# EAGLE design untitled2 (EAGLE 6.1)
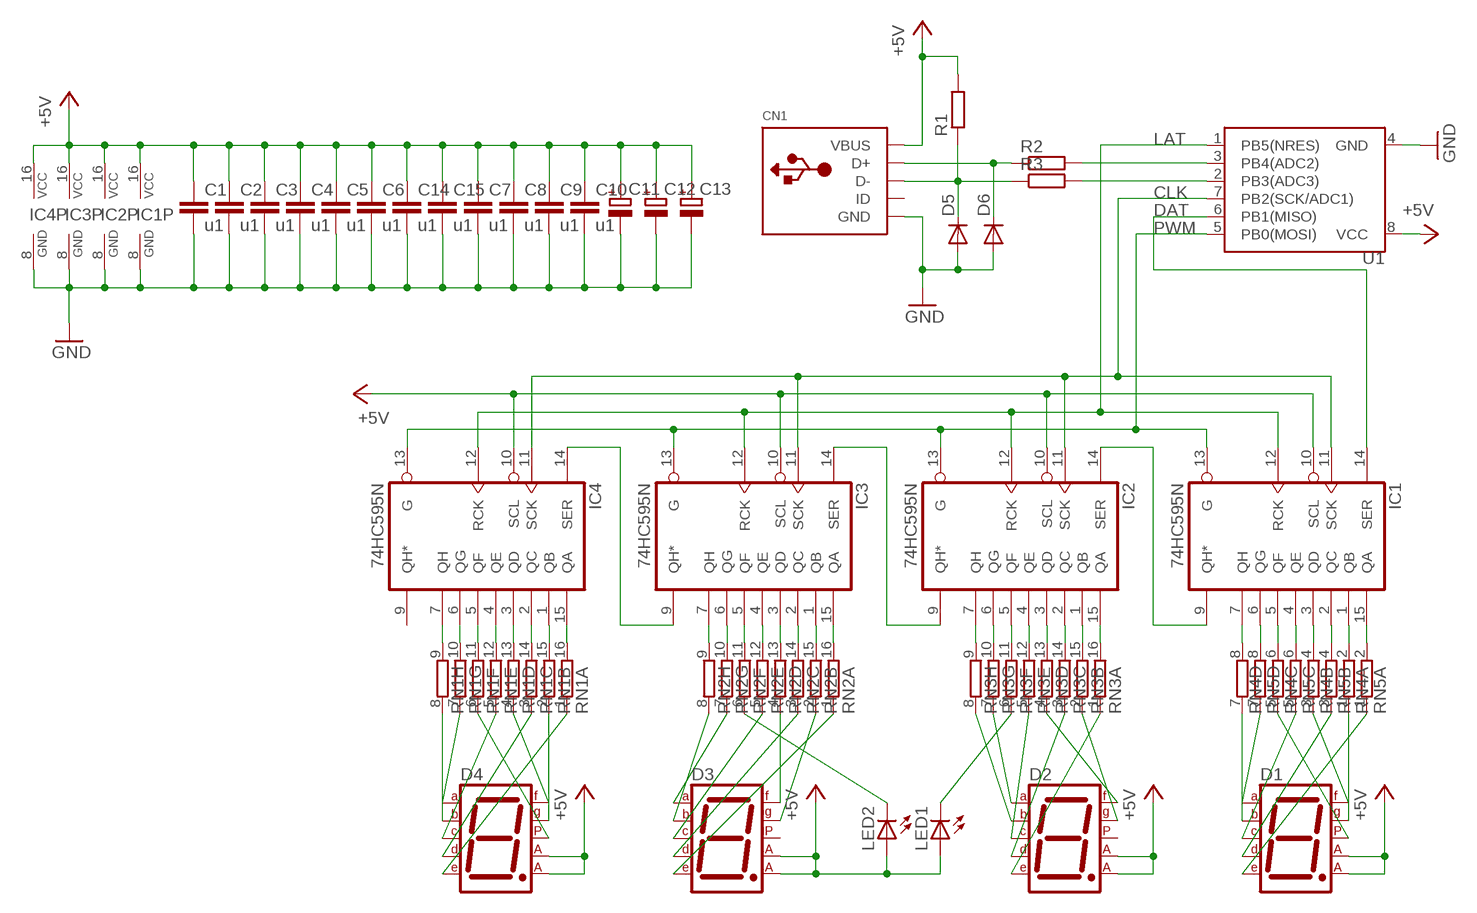
[diagram p0: schematic, sheet 1]

## Parts
C1  u1  C-EU025-025X050  [C025-025X050]
C2  u1  C-EU025-025X050  [C025-025X050]
C3  u1  C-EU025-025X050  [C025-025X050]
C4  u1  C-EU025-025X050  [C025-025X050]
C5  u1  C-EU025-025X050  [C025-025X050]
C6  u1  C-EU025-025X050  [C025-025X050]
C7  u1  C-EUC0805K  [C0805K]
C8  u1  C-EUC0805K  [C0805K]
C9  u1  C-EUC0805K  [C0805K]
C10  u1  C-EUC0805K  [C0805K]
C11  CPOL-EUE1.8-4  [E1,8-4]
C12  CPOL-EUE2.5-7  [E2,5-7]
C13  CPOL-EUE2.5-7  [E2,5-7]
C14  u1  C-EU025-025X050  [C025-025X050]
C15  u1  C-EU025-025X050  [C025-025X050]
CN1  USBTHM  [USB-MINIB-THM]
D1  7SEG-CA  [7SEG-13]
D2  7SEG-CA  [7SEG-13]
D3  7SEG-CA  [7SEG-13]
D4  7SEG-CA  [7SEG-13]
D5  DIODE-D-7.5  [D-7.5]
D6  DIODE-D-7.5  [D-7.5]
IC1  74HC595N  [DIL16]
IC2  74HC595N  [DIL16]
IC3  74HC595N  [DIL16]
IC4  74HC595N  [DIL16]
LED1  LED3MM  [LED3MM]
LED2  LED3MM  [LED3MM]
R1  R-EU_0204/7  [0204/7]
R2  R-EU_0204/7  [0204/7]
R3  R-EU_0204/7  [0204/7]
RN1  8R-N  [DIL16]
RN2  8R-N  [DIL16]
RN3  8R-N  [DIL16]
RN4  E4R  [SIL8]
RN5  E4R  [SIL8]
U1  ATTINY45ATTINYX5-20-DIP-GAP  [DIL08]

## Nets
+5V: C1.1 C2.1 C3.1 C4.1 C5.1 C6.1 C7.1 C8.1 C9.1 C10.1 C11.+ C12.+ C13.+ C14.1 C15.1 CN1.VBUS D1.3(CA1) D1.8(CA2) D2.3(CA1) D2.8(CA2) D3.3(CA1) D3.8(CA2) D4.3(CA1) D4.8(CA2) IC1.10(SCL) IC1.16(VCC) IC2.10(SCL) IC2.16(VCC) IC3.10(SCL) IC3.16(VCC) IC4.10(SCL) IC4.16(VCC) LED1.A LED2.A R1.2 U1.8(VCC)
CLK: IC1.11(SCK) IC2.11(SCK) IC3.11(SCK) IC4.11(SCK) U1.7(PB2(SCK/ADC1))
DAT: IC1.14(SER) U1.6(PB1(MISO))
GND: C1.2 C2.2 C3.2 C4.2 C5.2 C6.2 C7.2 C8.2 C9.2 C10.2 C11.- C12.- C13.- C14.2 C15.2 CN1.GND D5.A D6.A IC1.8(GND) IC2.8(GND) IC3.8(GND) IC4.8(GND) U1.4(GND)
LAT: IC1.12(RCK) IC2.12(RCK) IC3.12(RCK) IC4.12(RCK) U1.1(PB5(NRES))
N$1: D1.7(A) RN5.7
N$2: D1.6(B) RN4.7
N$3: D1.5(DP) RN4.5
N$4: D1.4(C) RN5.5
N$5: D1.9(F) RN4.3
N$6: D1.2(D) RN5.3
N$7: D1.10(G) RN4.1
N$8: D1.1(E) RN5.1
N$9: D4.9(F) RN1.4
N$10: D2.1(E) RN3.1
N$11: D2.2(D) RN3.3
N$12: D2.4(C) RN3.5
N$13: D2.7(A) RN3.7
N$14: D2.6(B) RN3.8
N$15: LED2.K(C) RN2.6
N$16: D2.9(F) RN3.4
N$17: D2.10(G) RN3.2
N$18: D3.1(E) RN2.1
N$19: D3.2(D) RN2.3
N$20: D3.4(C) RN2.5
N$21: D3.7(A) RN2.7
N$22: D3.6(B) RN2.8
N$23: LED1.K(C) RN3.6
N$24: D3.9(F) RN2.4
N$25: D3.10(G) RN2.2
N$26: D4.1(E) RN1.1
N$27: D4.2(D) RN1.3
N$28: D4.4(C) RN1.5
N$29: D4.7(A) RN1.7
N$30: IC1.9(QH*) IC2.14(SER)
N$31: IC2.9(QH*) IC3.14(SER)
N$32: IC3.9(QH*) IC4.14(SER)
N$33: IC1.7(QH) RN4.8
N$34: IC1.15(QA) RN5.2
N$35: IC1.1(QB) RN4.2
N$36: IC1.2(QC) RN5.4
N$37: IC1.3(QD) RN4.4
N$38: IC1.4(QE) RN5.6
N$39: IC1.5(QF) RN4.6
N$40: IC1.6(QG) RN5.8
N$41: IC2.7(QH) RN3.9
N$42: IC2.15(QA) RN3.16
N$43: D4.6(B) RN1.8
N$44: D4.5(DP) RN1.6
N$45: D4.10(G) RN1.2
N$46: R2.2 U1.3(PB4(ADC2))
N$47: CN1.D- D5.C R1.1 R3.1
N$48: CN1.D+ D6.C R2.1
N$49: R3.2 U1.2(PB3(ADC3))
N$50: IC3.15(QA) RN2.16
N$53: IC3.3(QD) RN2.13
N$55: IC3.5(QF) RN2.11
N$62: IC3.7(QH) RN2.9
N$76: IC4.7(QH) RN1.9
N$77: IC4.5(QF) RN1.11
N$78: IC4.6(QG) RN1.10
N$79: IC4.4(QE) RN1.12
N$80: IC4.3(QD) RN1.13
N$81: IC4.2(QC) RN1.14
N$82: IC4.1(QB) RN1.15
N$83: IC4.15(QA) RN1.16
N$91: IC2.1(QB) RN3.15
N$92: IC2.2(QC) RN3.14
N$93: IC2.3(QD) RN3.13
N$94: IC2.4(QE) RN3.12
N$95: IC2.5(QF) RN3.11
N$96: IC2.6(QG) RN3.10
N$97: IC3.1(QB) RN2.15
N$98: IC3.2(QC) RN2.14
N$99: IC3.4(QE) RN2.12
N$100: IC3.6(QG) RN2.10
PWM: IC1.13(G) IC2.13(G) IC3.13(G) IC4.13(G) U1.5(PB0(MOSI))
Unconnected: CN1.ID D2.5(DP) D3.5(DP) IC4.9(QH*)

## Library data of the parts
C1-C10 C14 C15 = rcl:C-EU: CAPACITOR, European symbol
C11-C13 = rcl:CPOL-EU: POLARIZED CAPACITOR, European symbol
CN1 = adafruit:USB: USB Connectors USBMINIB - Surface Mount Female Mini-B USB Connector 4UConnector: 06564 By microbuilder.eu Thru-hole RA Female Mini-B USB Connector 4UConnector: 18732 By ladyada.net
D1-D4 = special:7SEG-CA: 7-segment DISPLAY single anode, 13 mm
D5 D6 = diode:DIODE-: DIODE
IC1-IC4 = 74xx-eu:74*595: 8-bit SHIFT REGISTER, output latch
LED1 LED2 = led:LED: LED OSRAM: - CHIPLED LG R971, LG N971, LY N971, LG Q971, LY Q971, LO R971, LY R971 LH N974, LH R974 LS Q976, LO Q976, LY Q976 LO Q996 - Hyper CHIPLED LW Q18S LB Q993, LB Q99A, LB R99A - SideLED LS A670, LO A670, LY A670, LG A670, LP A670 LB A673, LV A673, LT A673, LW A673 LH A674 LY A675 LS A676, LA A676, LO A676, LY A676, LW A676 LS A679, LY A679, LG A679 - Hyper Micro SIDELED® LS Y876, LA Y876, LO Y876, LY Y876 LT Y87S - SmartLED LW L88C, LW L88S LB L89C, LB L89S, LG L890 LS L89K, LO L89K, LY L89K LS L896, LA L896, LO L896, LY L896 - TOPLED LS T670, LO T670, LY T670, LG T670, LP T670 LSG T670, LSP T670, LSY T670, LOP T670, LYG T670 LG T671, LOG T671, LSG T671 LB T673, LV T673, LT T673, LW T673 LH T674 LS T676, LA T676, LO T676, LY T676, LB T676, LH T676, LSB T676, LW T676 LB T67C, LV T67C, LT T67C, LS T67K, LO T67K, LY T67K, LW E67C LS E67B, LA E67B, LO E67B, LY E67B, LB E67C, LV E67C, LT E67C LW T67C LS T679, LY T679, LG T679 LS T770, LO T770, LY T770, LG T770, LP T770 LB T773, LV T773, LT T773, LW T773 LH T774 LS E675, LA E675, LY E675, LS T675 LS T776, LA T776, LO T776, LY T776, LB T776 LHGB T686 LT T68C, LB T68C - Hyper Mini TOPLED® LB M676 - Mini TOPLED Santana® LG M470 LS M47K, LO M47K, LY M47K Source: http://www.osram.convergy.de LUXEON: - LUMILED® LXK2-PW12-R00, LXK2-PW12-S00, LXK2-PW14-U00, LXK2-PW14-V00 LXK2-PM12-R00, LXK2-PM12-S00, LXK2-PM14-U00 LXK2-PE12-Q00, LXK2-PE12-R00, LXK2-PE12-S00, LXK2-PE14-T00, LXK2-PE14-U00 LXK2-PB12-K00, LXK2-PB12-L00, LXK2-PB12-M00, LXK2-PB14-N00, LXK2-PB14-P00, LXK2-PB14-Q00 LXK2-PR12-L00, LXK2-PR12-M00, LXK2-PR14-Q00, LXK2-PR14-R00 LXK2-PD12-Q00, LXK2-PD12-R00, LXK2-PD12-S00 LXK2-PH12-R00, LXK2-PH12-S00 LXK2-PL12-P00, LXK2-PL12-Q00, LXK2-PL12-R00 Source: www.luxeon.com KINGBRIGHT: KA-3528ASYC Source: www.kingbright.com
R1-R3 = rcl:R-EU_: RESISTOR, European symbol
RN1-RN3 = resistor-dil:8R-N: DIL RESISTOR; OC_FARNELL: unknown; OC_NEWARK: unknown
RN4 RN5 = resistor-sil:E4R: SIL RESISTOR; OC_FARNELL: unknown; OC_NEWARK: unknown
U1 = _MY_OWN_LIB:ATTINY45: Atmel 8-pin 2/4/8kB flash uC

## Board
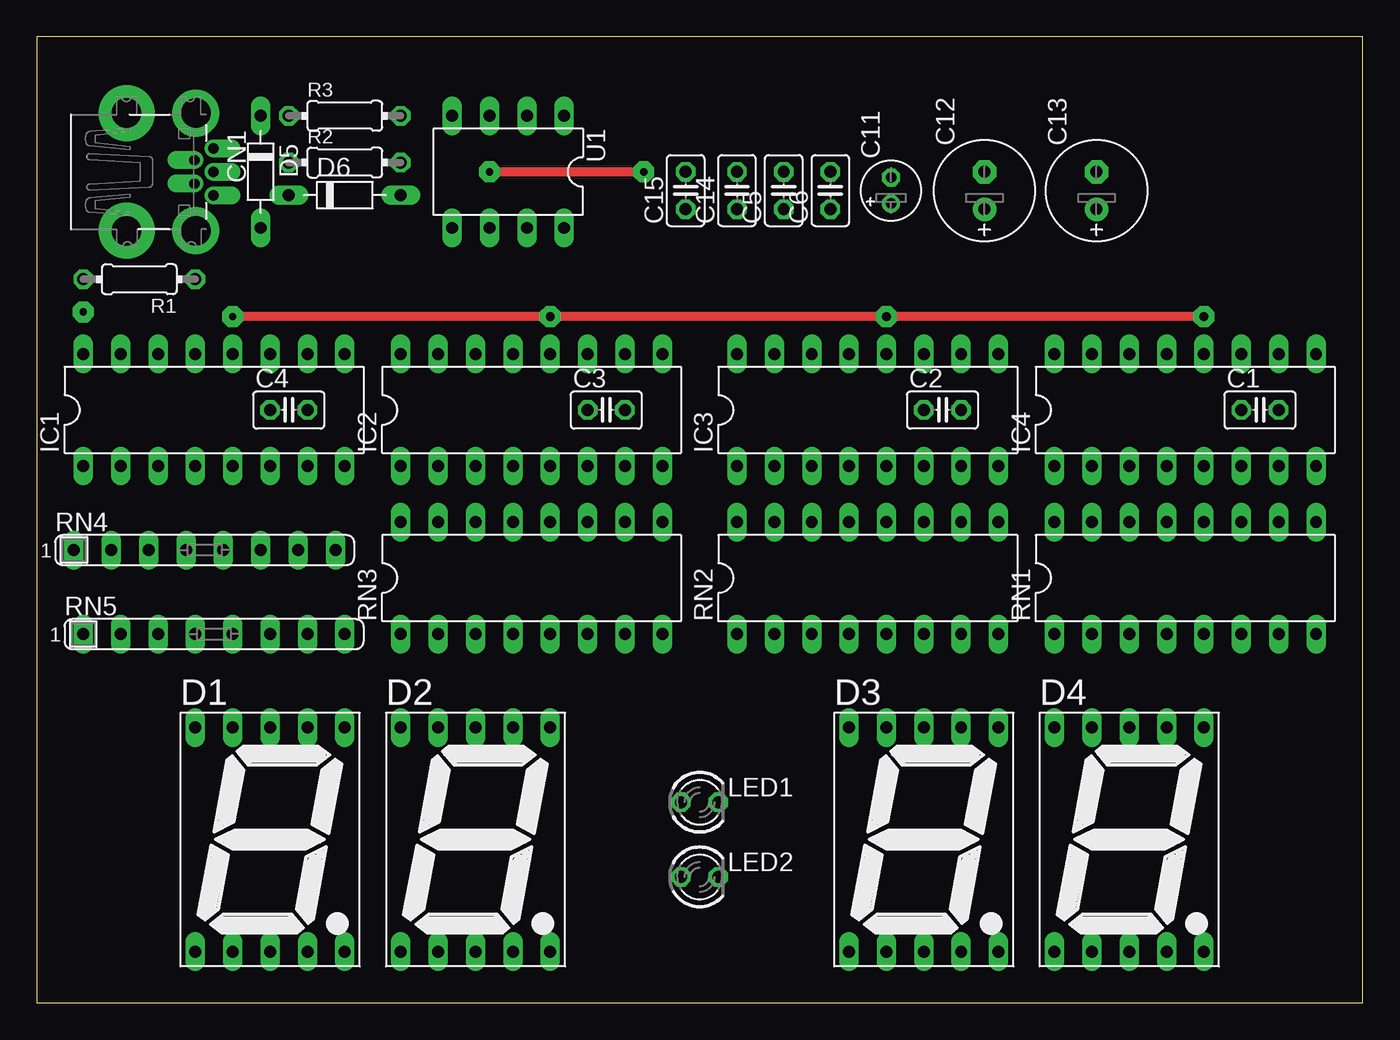
[diagram p1: board, top side]
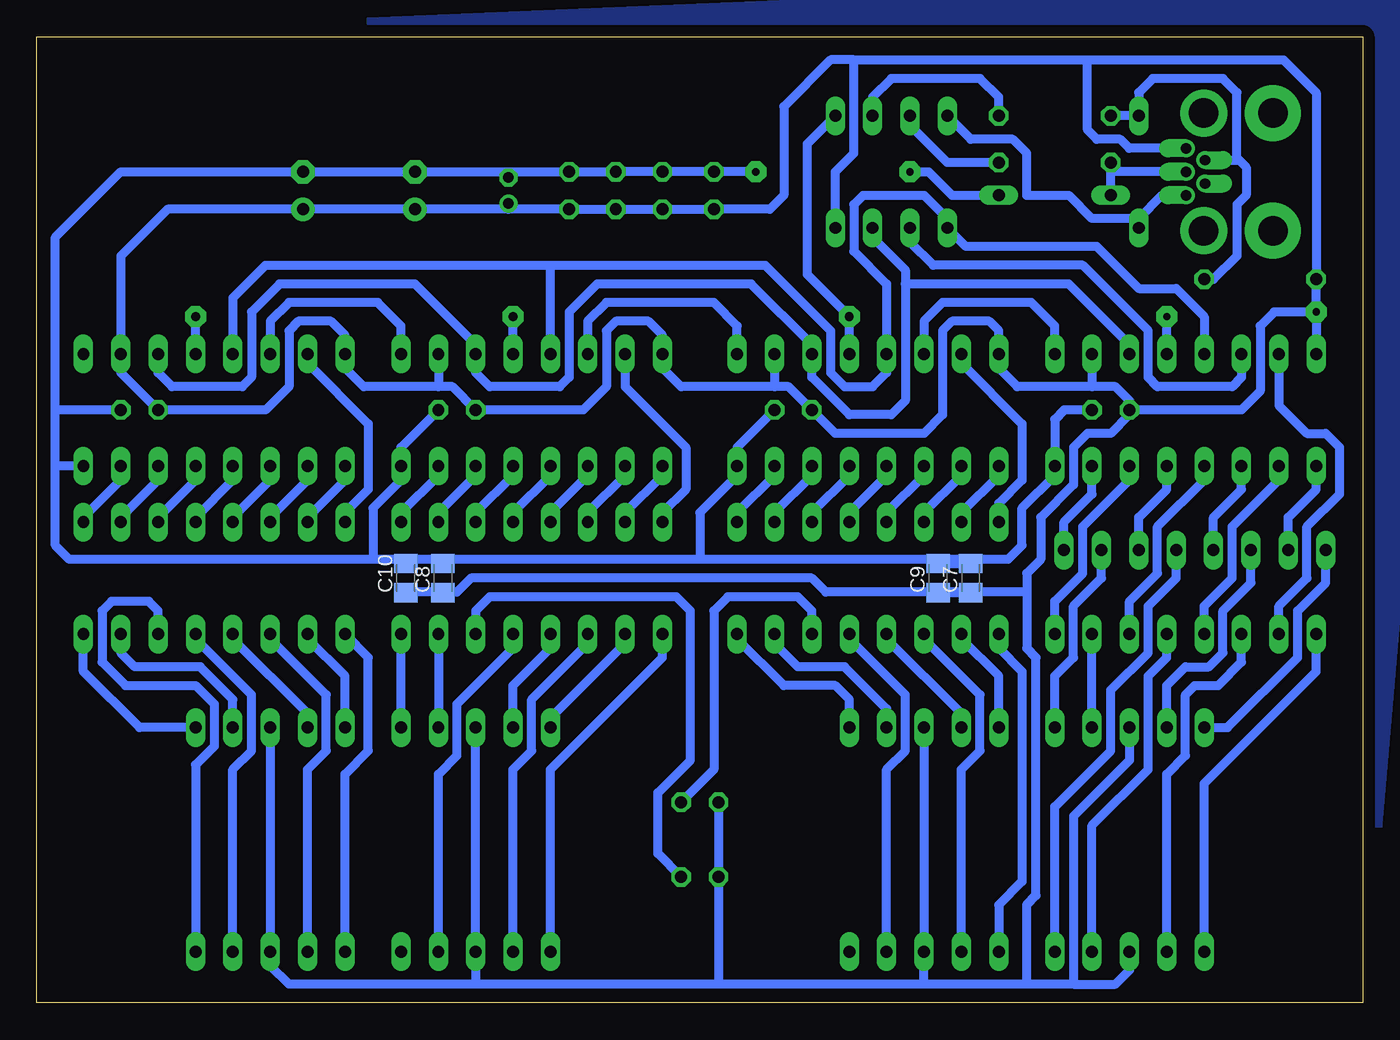
[diagram p2: board, bottom side, seen from below]

Size 90.16 x 65.7 mm. Coordinates in mm from the lower left corner, seen from the top.
Outline: 90.16,0 90.16,65.7 0,65.7 0,0 90.16,0
Copper layers (1*16): Top 0.035mm / dielectric 1.5mm / Bottom 0.035mm
Design rules: minimum track width 10mil, minimum drill 24mil, track to track 12mil, track to pad 12mil, pad to pad 12mil, via to via 12mil, smd to smd 10mil, copper to edge 12mil, drill to drill 12mil, minimum pad ring 10mil, minimum via ring 10mil, stop-mask expansion 4mil, vias tented up to drill 0mil, thermal gap 12mil

### Footprints (pad centres in the part's own frame; a part is rotated, then mirrored left to right if it is on the bottom)
C025-025X050 = drill 0.813 octagon: 1 -1.27,0; 2 1.27,0
C0805K = smd 1.3 x 1.6: 1 -1,0; 2 1,0
E1,8-4 = drill 0.711 pad 1.168: + -0.889,0 | drill 0.711 pad 1.168 octagon: - 0.889,0
E2,5-7 = drill 0.813 pad 1.6: + -1.27,0 | drill 0.813 pad 1.6 octagon: - 1.27,0
USB-MINIB-THM = drill 0.7 offset: D+ 0,9.8; D- -0.8,8.5; GND 1.6,9.8; ID 0.8,8.5; VBUS -1.6,9.8 | drill 2 pad 3.81: GND1 -4,3.9; GND4 4,3.9 | drill 2 pad 3.2: GND2 -4,8.6; GND3 4,8.6
7SEG-13 = drill 0.813 long: 1 -5.08,-7.62; 2 -2.54,-7.62; 3 0,-7.62; 4 2.54,-7.62; 5 5.08,-7.62; 6 5.08,7.62; 7 2.54,7.62; 8 0,7.62; 9 -2.54,7.62; 10 -5.08,7.62
D-7.5 = drill 0.813 long: A 3.81,0; C -3.81,0
DIL16 = drill 0.813 long: 1 -8.89,-3.81; 2 -6.35,-3.81; 3 -3.81,-3.81; 4 -1.27,-3.81; 5 1.27,-3.81; 6 3.81,-3.81; 7 6.35,-3.81; 8 8.89,-3.81; 9 8.89,3.81; 10 6.35,3.81; 11 3.81,3.81; 12 1.27,3.81; 13 -1.27,3.81; 14 -3.81,3.81; 15 -6.35,3.81; 16 -8.89,3.81
LED3MM = drill 0.813 octagon: A -1.27,0; K 1.27,0
0204/7 = drill 0.813 octagon: 1 -3.81,0; 2 3.81,0
SIL8 = drill 0.813 long: 1 -8.89,0; 2 -6.35,0; 3 -3.81,0; 4 -1.27,0; 5 1.27,0; 6 3.81,0; 7 6.35,0; 8 8.89,0
DIL08 = drill 0.813 long: 1 -3.81,-3.81; 2 -1.27,-3.81; 3 1.27,-3.81; 4 3.81,-3.81; 5 3.81,3.81; 6 1.27,3.81; 7 -1.27,3.81; 8 -3.81,3.81

### Placement (x,y rotation side)
C1  83.17,40.32 0 top
C2  61.58,40.32 0 top
C3  38.72,40.32 0 top
C4  17.13,40.32 0 top
C5  50.79,55.24 90 top
C6  53.96,55.24 90 top
C7  26.66,28.89 90 bottom
C8  62.53,28.89 90 bottom
C9  28.88,28.89 90 bottom
C10  65.08,28.89 90 bottom
C11  58.09,55.24 90 top
C12  64.44,55.24 90 top
C13  72.06,55.24 90 top
C14  47.61,55.24 90 top
C15  44.12,55.24 90 top
CN1  2.21,56.52 270 top
D1  15.86,11.11 0 top
D2  29.83,11.11 0 top
D3  60.31,11.11 0 top
D4  74.28,11.11 0 top
D5  15.23,56.52 270 top
D6  20.94,54.93 0 top
IC1  12.05,40.32 0 top
IC2  33.64,40.32 0 top
IC3  56.5,40.32 0 top
IC4  78.09,40.32 0 top
LED1  45.07,13.65 0 top
LED2  45.07,8.57 0 top
R1  6.97,49.21 180 top
R2  20.94,57.15 0 top
R3  20.94,60.33 0 top
RN1  78.09,28.89 0 top
RN2  56.5,28.89 0 top
RN3  33.64,28.89 0 top
RN4  11.42,30.8 0 top
RN5  12.05,25.08 0 top
U1  32.05,56.52 180 top

### Tracks (layer width: path | path; a pad name or v marks a point on that pad's centre or on a via)
+5V  (via drill 0.5 pad 1.42)
  Bottom 0.61: v3.16,46.99 IC1.16 | D1.8 15.86,16.51 19.67,12.7 19.67,1.27 | 19.67,1.27 16.82,1.27 15.86,2.22 D1.3 | 22.85,1.27 29.83,1.27 | 29.83,1.27 D2.3 D2.8 | 29.83,1.27 43.8,1.27 | 43.8,1.27 60.31,1.27 | 60.31,1.27 D3.3 D3.8 | D4.8 D4.3 74.28,2.54 73.01,1.27 60.31,1.27 | LED2.A LED1.A 43.8,1.27 | C4.1 15.86,40.01 17.13,38.73 18.72,38.73 19.67,37.78 19.67,35.24 21.89,33.02 21.89,30.16 22.85,29.21 22.85,27.94 | 22.85,27.94 22.85,24.13 22.21,23.5 22.21,7.3 22.85,6.67 22.85,1.27 | 19.67,1.27 22.85,1.27 | CN1.VBUS 15.87,58.12 16.5,58.74 18.09,58.74 18.72,59.37 18.72,64.14 | 18.72,64.14 5.38,64.14 3.16,61.91 R1.2 v3.16,46.99 | v3.16,46.99 6.02,46.99 6.97,46.04 6.97,41.59 8.24,40.32 C4.1 | C4.1 15.86,40.96 16.82,41.91 18.4,41.91 | 18.4,41.91 23.48,41.91 24.75,43.18 IC2.16 24.75,45.72 25.39,46.35 27.93,46.35 28.56,45.72 28.56,40.01 29.83,38.73 35.86,38.73 C3.1 39.04,41.91 39.99,41.91 | IC1.10 18.4,41.91 | 39.99,41.91 46.34,41.91 47.61,43.18 IC3.16 47.61,45.4 48.57,46.35 50.79,46.35 51.42,45.72 51.42,41.91 53.01,40.32 C2.1 61.9,41.91 62.85,41.91 | IC2.10 39.99,41.91 | 62.85,41.91 67.93,41.91 69.2,43.18 IC4.16 69.2,45.4 70.16,46.35 72.38,46.35 73.01,45.72 73.01,41.91 74.6,40.32 C1.1 84.44,42.86 IC4.10 84.44,50.8 81.27,53.98 C13.+ C12.+ 58.09,53.98 | IC3.10 62.85,41.91 | U1.8 35.86,56.52 34.6,57.78 34.6,64.14 | 34.6,64.14 18.72,64.14 | 34.6,64.14 36.18,64.14 39.36,60.96 39.36,54.93 40.31,53.98 C15.1 C14.1 C5.1 C6.1 58.09,53.98 | C11.+ 58.09,53.98 | 22.85,27.94 28.88,27.94 | 28.88,27.94 36.5,27.94 37.45,28.89 60.63,28.89 61.58,27.94 62.49,27.94 | 62.49,27.94 65.08,27.94 C10.1 | 28.88,27.94 28.83,27.89 C7.1 C9.1
  Bottom 0.61: 62.49,27.94 C8.1
CLK
  Bottom 0.61: IC1.11 15.86,44.77 19.99,48.9 31.1,48.9 | 31.1,48.9 31.1,49.85 33.32,52.07 U1.7 | 31.1,48.9 31.1,40.96 32.06,40.01 34.91,40.01 37.45,42.55 IC2.11 37.45,44.77 41.58,48.9 52.06,48.9 53.96,46.99 53.96,42.55 54.6,41.91 59.36,41.91 60.31,42.86 IC3.11 60.31,44.77 64.44,48.9 73.65,48.9 75.55,46.99 75.55,42.55 76.19,41.91 80.95,41.91 81.9,42.86 IC4.11
DAT
  Bottom 0.61: IC1.14 8.24,42.55 8.88,41.91 13.96,41.91 14.59,42.55 14.59,45.72 19.04,50.16 29.2,50.16 30.78,51.75 U1.6
GND  (via drill 0.5 pad 1.42)
  Top 0.61: v30.78,56.52 v41.26,56.52
  Bottom 0.61: C3.2 42.53,37.78 IC2.8 42.53,35.88 45.07,33.34 45.07,30.16 | 67.3,30.16 67.3,33.66 65.39,35.56 IC3.8 65.39,37.78 C2.2 | 67.3,30.16 87.94,30.16 88.89,31.11 88.89,36.51 | 45.07,30.16 62.53,30.16 | 62.53,30.16 65.08,30.16 | 65.08,30.16 67.3,30.16 | 26.66,30.16 24.12,30.16 23.16,31.11 23.16,33.66 20.94,35.88 IC1.8 20.94,39.69 20.31,40.32 C4.2 | 26.66,30.16 45.07,30.16 | 88.89,36.51 88.89,40.32 | 88.89,40.32 88.89,52.07 84.44,56.52 C13.- C12.- 58.09,56.52 | CN1.GND 13.65,54.91 15.23,53.34 | 15.23,53.34 18.4,53.34 19.99,54.93 22.85,54.93 22.85,57.78 23.8,58.74 26.66,58.74 U1.4 | D5.A 15.23,53.34 | C1.2 88.89,40.32 | IC4.8 88.89,36.51 | 58.09,56.52 C6.2 C5.2 C14.2 C15.2 v41.26,56.52 | 58.09,56.2 C11.- 58.09,56.52 | C9.2 C7.2 26.66,30.16 | C8.2 62.53,30.16 | C10.2 65.08,30.16 | v30.78,56.52 29.51,56.52 27.93,54.93 D6.A
  pour Bottom (isolate 0.813, no thermals): -0.01,0 -6.04,69.85 90.16,65.72 -0.01,65.72
LAT  (via drill 0.5 pad 1.42, 0.6 pad 1.42)
  Top 0.61: v79.36,46.67 v57.77,46.67 v34.91,46.67 v13.32,46.67
  Bottom 0.61: IC4.12 v79.36,46.67 | IC3.12 v57.77,46.67 | IC2.12 v34.91,46.67 37.77,49.53 37.77,58.42 U1.1 | IC1.12 v13.32,46.67
N$1
  Bottom 0.61: D1.7 RN5.7
N$2
  Bottom 0.61: D1.6 20.94,22.23 19.67,23.5 19.67,26.99 17.77,28.89 RN4.7
N$3
  Bottom 0.61: D1.5 20.94,13.34 17.13,17.14 17.13,21.27 14.59,23.81 14.59,26.99 12.69,28.89 RN4.5
N$4
  Bottom 0.61: D1.4 18.4,12.06 14.59,15.88 14.59,22.23 13.32,23.5 RN5.5
N$5
  Bottom 0.61: D1.9 13.32,21.59 12.05,22.86 10.46,22.86 9.51,23.81 9.51,26.67 7.61,28.57 RN4.3
N$6
  Bottom 0.61: D1.2 13.32,15.56 12.05,16.83 12.05,20.95 11.42,21.59 9.83,21.59 8.24,23.18 RN5.3
N$7
  Bottom 0.61: D1.10 9.19,18.73 4.43,23.5 4.43,26.67 2.53,28.57 RN4.1
N$8
  Bottom 0.61: D1.1 10.78,14.92 3.16,22.54 RN5.1
N$9
  Bottom 0.61: D4.9 71.74,19.68 76.82,24.77 RN1.4
N$10
  Bottom 0.61: RN3.1 24.75,24.13 23.16,22.54 23.16,8.26 24.75,6.67 D2.1
N$11
  Bottom 0.61: D2.2 27.29,15.88 26.02,17.14 26.02,20.95 29.83,24.77 RN3.3
N$12
  Bottom 0.61: D2.4 32.37,15.88 31.1,17.14 31.1,20.95 34.91,24.77 RN3.5
N$13
  Bottom 0.61: D2.7 32.37,20 35.23,22.86 38.4,22.86 39.99,24.45 RN3.7
N$14
  Bottom 0.61: D2.6 34.91,20.64 35.86,21.59 39.36,21.59 42.53,24.77 RN3.8
N$15
  Bottom 0.61: LED2.K 47.93,10.16 47.93,14.29 45.71,16.51 45.71,26.67 46.66,27.62 59.36,27.62 60.31,26.67 RN2.6
N$16
  Bottom 0.61: D2.9 27.29,19.68 32.37,24.77 RN3.4
N$17
  Bottom 0.61: D2.10 24.75,22.23 27.29,24.77 RN3.2
N$18
  Bottom 0.61: D3.1 55.23,15.88 47.61,23.5 RN2.1
N$19
  Bottom 0.61: D3.2 57.77,15.88 56.5,17.14 56.5,20.64 52.69,24.45 RN2.3
N$20
  Bottom 0.61: D3.4 62.85,15.56 61.58,16.83 61.58,20.32 57.77,24.13 RN2.5
N$21
  Bottom 0.61: RN2.7 D3.7
N$22
  Bottom 0.61: D3.6 RN2.8
N$23
  Bottom 0.61: RN3.6 37.45,26.67 38.4,27.62 43.17,27.62 44.12,26.67 44.12,15.88 LED1.K
N$24
  Bottom 0.61: D3.9 57.77,21.59 55.23,24.13 RN2.4
N$25
  Bottom 0.61: D3.10 55.23,19.37 50.15,24.45 RN2.2
N$26
  Bottom 0.61: D4.1 69.2,15.56 67.61,17.14 67.61,23.5 RN1.1
N$27
  Bottom 0.61: D4.2 71.74,15.88 70.47,17.14 70.47,20.95 74.28,24.77 RN1.3
N$28
  Bottom 0.61: D4.4 76.82,15.88 75.55,17.14 75.55,20.95 79.36,24.77 RN1.5
N$29
  Bottom 0.61: D4.7 76.82,20.64 79.05,22.86 83.49,22.86 84.44,23.81 RN1.7
N$30
  Bottom 0.61: IC1.9 20.94,46.04 22.53,47.62 28.56,47.62 29.83,46.35 IC2.14
N$31
  Bottom 0.61: IC2.9 42.53,46.04 44.12,47.62 51.42,47.62 52.69,46.35 IC3.14
N$32
  Bottom 0.61: IC3.9 65.39,46.04 66.98,47.62 73.01,47.62 74.28,46.35 IC4.14
N$33
  Bottom 0.61: RN4.8 20.31,32.7 18.4,34.61 IC1.7
N$34
  Bottom 0.61: IC1.15 5.7,40.64 3.8,38.73 2.53,38.73 1.57,37.78 1.57,34.61 3.8,32.38 3.8,28.89 5.7,26.99 RN5.2
N$35
  Bottom 0.61: RN4.2 5.07,33.02 3.16,34.92 IC1.1
N$36
  Bottom 0.61: RN5.4 10.78,26.99 8.88,28.89 8.88,32.38 5.7,35.56 IC1.2
N$37
  Bottom 0.61: RN4.4 10.15,33.02 8.24,34.92 IC1.3
N$38
  Bottom 0.61: RN5.6 15.86,27.3 13.96,29.21 13.96,32.38 10.78,35.56 IC1.4
N$39
  Bottom 0.61: RN4.6 15.23,33.02 13.32,34.92 IC1.5
N$40
  Bottom 0.61: RN5.8 20.94,27.3 19.04,29.21 19.04,32.38 15.86,35.56 IC1.6
N$41
  Bottom 0.61: RN3.9 42.53,33.34 39.99,35.88 IC2.7
N$42
  Bottom 0.61: IC2.15 27.29,43.5 23.16,39.37 23.16,35.56 24.75,33.97 RN3.16
N$43
  Bottom 0.61: D4.6 83.17,18.73 86.98,22.54 RN1.8
N$44
  Bottom 0.61: RN1.6 81.9,26.67 82.54,27.3 85.08,27.3 85.71,26.67 85.71,23.18 84.13,21.59 79.36,21.59 78.09,20.32 78.09,17.46 79.36,16.19 D4.5
N$45
  Bottom 0.61: D4.10 69.2,22.23 71.74,24.77 RN1.2
N$46
  Bottom 0.61: R2.2 28.25,57.15 30.78,59.69 U1.3
N$47
  Bottom 0.61: R3.1 D5.C 15.23,61.91 14.27,62.87 9.51,62.87 8.56,61.91 8.56,57.47 8.71,57.31 CN1.D- 8.41,57.31 7.93,56.83 7.93,54.93 8.56,54.29 8.56,50.8 10.15,49.21 R1.1
N$48
  Bottom 0.61: CN1.D+ 17.13,56.52 | 17.13,56.52 R2.1 | D6.C 17.13,56.52
N$49
  Bottom 0.61: R3.2 24.75,61.59 26.02,62.87 32.06,62.87 33.32,61.59 U1.2
N$50
  Bottom 0.61: IC3.15 50.15,41.91 46.03,37.78 46.03,34.92 47.61,33.34 RN2.16
N$53
  Bottom 0.61: RN2.13 55.23,33.34 52.69,35.88 IC3.3
N$55
  Bottom 0.61: RN2.11 60.31,33.34 57.77,35.88 IC3.5
N$62
  Bottom 0.61: RN2.9 65.39,33.34 62.85,35.88 IC3.7
N$76
  Bottom 0.61: RN1.9 86.98,33.02 84.44,35.56 IC4.7
N$77
  Bottom 0.61: RN1.11 81.9,33.02 79.36,35.56 IC4.5
N$78
  Bottom 0.61: RN1.10 84.44,33.02 81.9,35.56 IC4.6
N$79
  Bottom 0.61: RN1.12 79.36,33.02 76.82,35.56 IC4.4
N$80
  Bottom 0.61: RN1.13 76.82,33.02 74.28,35.56 IC4.3
N$81
  Bottom 0.61: RN1.14 74.28,33.02 71.74,35.56 IC4.2
N$82
  Bottom 0.61: RN1.15 71.74,33.02 69.2,35.56 IC4.1
N$83
  Bottom 0.61: IC4.15 71.74,43.5 67.61,39.37 67.61,34.92 69.2,33.34 RN1.16
N$91
  Bottom 0.61: RN3.15 27.29,33.34 24.75,35.88 IC2.1
N$92
  Bottom 0.61: IC2.2 27.29,35.88 29.83,33.34 RN3.14
N$93
  Bottom 0.61: RN3.13 32.37,33.34 29.83,35.88 IC2.3
N$94
  Bottom 0.61: RN3.12 34.91,33.34 32.37,35.88 IC2.4
N$95
  Bottom 0.61: RN3.11 37.45,33.34 34.91,35.88 IC2.5
N$96
  Bottom 0.61: RN3.10 39.99,33.34 37.45,35.88 IC2.6
N$97
  Bottom 0.61: RN2.15 50.15,33.34 47.61,35.88 IC3.1
N$98
  Bottom 0.61: RN2.14 52.69,33.34 50.15,35.88 IC3.2
N$99
  Bottom 0.61: RN2.12 57.77,33.34 55.23,35.88 IC3.4
N$100
  Bottom 0.61: RN2.10 62.85,33.34 60.31,35.88 IC3.6
PWM
  Bottom 0.61: IC3.13 55.23,50.16 | IC4.13 76.82,47.94 74.6,50.16 55.23,50.16 | 55.23,50.16 40.63,50.16 36.18,45.72 36.18,42.86 35.23,41.91 33.32,41.91 32.37,42.86 IC2.13 32.37,48.9 34.6,51.12 34.6,54.29 33.96,54.93 29.83,54.93 28.25,53.34 U1.5 26.98,51.44 18.09,51.44 15.23,48.58 12.69,48.58 10.78,46.67 IC1.13